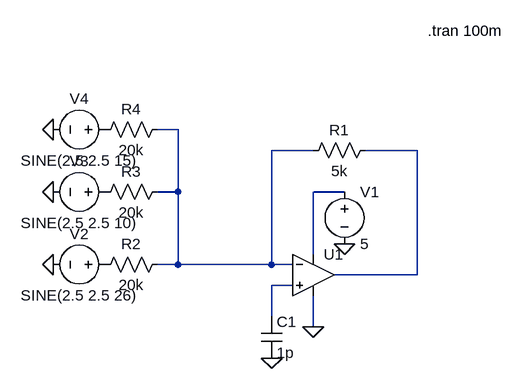
[diagram p0: schematic Draft1.asc]
Draft1.asc, the LTspice schematic file:
Version 4
SHEET 1 880 680
WIRE 32 -16 0 -16
WIRE 240 16 176 16
WIRE 400 16 320 16
WIRE 32 80 32 -16
WIRE 32 80 0 80
WIRE 288 80 240 80
WIRE 240 176 240 80
WIRE 32 192 32 80
WIRE 32 192 0 192
WIRE 176 192 176 16
WIRE 176 192 32 192
WIRE 208 192 176 192
WIRE 400 208 400 16
WIRE 400 208 272 208
WIRE 208 224 176 224
WIRE 176 272 176 224
WIRE 240 288 240 240
FLAG 240 288 0
FLAG 288 160 0
FLAG 176 336 0
FLAG -160 -16 0
FLAG -160 80 0
FLAG -160 192 0
SYMBOL voltage 288 64 R0
WINDOW 123 0 0 Left 0
WINDOW 39 0 0 Left 0
SYMATTR InstName V1
SYMATTR Value 5
SYMBOL res 336 0 R90
WINDOW 0 0 56 VBottom 2
WINDOW 3 32 56 VTop 2
SYMATTR InstName R1
SYMATTR Value 5k
SYMBOL res 16 176 R90
WINDOW 0 0 56 VBottom 2
WINDOW 3 32 56 VTop 2
SYMATTR InstName R2
SYMATTR Value 20k
SYMBOL res 16 64 R90
WINDOW 0 0 56 VBottom 2
WINDOW 3 32 56 VTop 2
SYMATTR InstName R3
SYMATTR Value 20k
SYMBOL res 16 -32 R90
WINDOW 0 0 56 VBottom 2
WINDOW 3 32 56 VTop 2
SYMATTR InstName R4
SYMATTR Value 20k
SYMBOL voltage -64 80 R90
WINDOW 0 -32 56 VBottom 2
WINDOW 3 32 56 VTop 2
WINDOW 123 0 0 Left 0
WINDOW 39 0 0 Left 0
SYMATTR InstName V3
SYMATTR Value SINE(2.5 2.5 10)
SYMBOL voltage -64 192 R90
WINDOW 0 -32 56 VBottom 2
WINDOW 3 32 56 VTop 2
WINDOW 123 0 0 Left 0
WINDOW 39 0 0 Left 0
SYMATTR InstName V2
SYMATTR Value SINE(2.5 2.5 26)
SYMBOL voltage -64 -16 R90
WINDOW 0 -32 56 VBottom 2
WINDOW 3 32 56 VTop 2
WINDOW 123 0 0 Left 0
WINDOW 39 0 0 Left 0
SYMATTR InstName V4
SYMATTR Value SINE(2.5 2.5 15)
SYMBOL cap 160 272 R0
SYMATTR InstName C1
SYMATTR Value 1p
SYMBOL OpAmps\\UniversalOpAmp2 240 208 R0
SYMATTR InstName U1
TEXT 416 -168 Left 2 !.tran 100m

The netlist it stands for:
* Draft1.asc
V1 N003 0 5
R1 N002 N001 5k
R2 N001 P001 20k
R3 N001 P002 20k
R4 N001 P003 20k
V3 P002 0 SINE(2.5 2.5 10)
V2 P001 0 SINE(2.5 2.5 26)
V4 P003 0 SINE(2.5 2.5 15)
C1 N004 0 1p
XU1 N004 N001 N003 0 N002 level2 Avol=1Meg GBW=10Meg Slew=10Meg Ilimit=25m Rail=0 Vos=0 En=0 Enk=0 In=0 Ink=0 Rin=500Meg  ; pins In+ In- V+ V- OUT
.tran 100m
.lib UniversalOpAmp2.lib
.backanno
.end